# Altium schematic sheet 06_POWER_3.SchDoc
size 420 x 297 mm; SheetNumber: 9; SheetTotal: 35
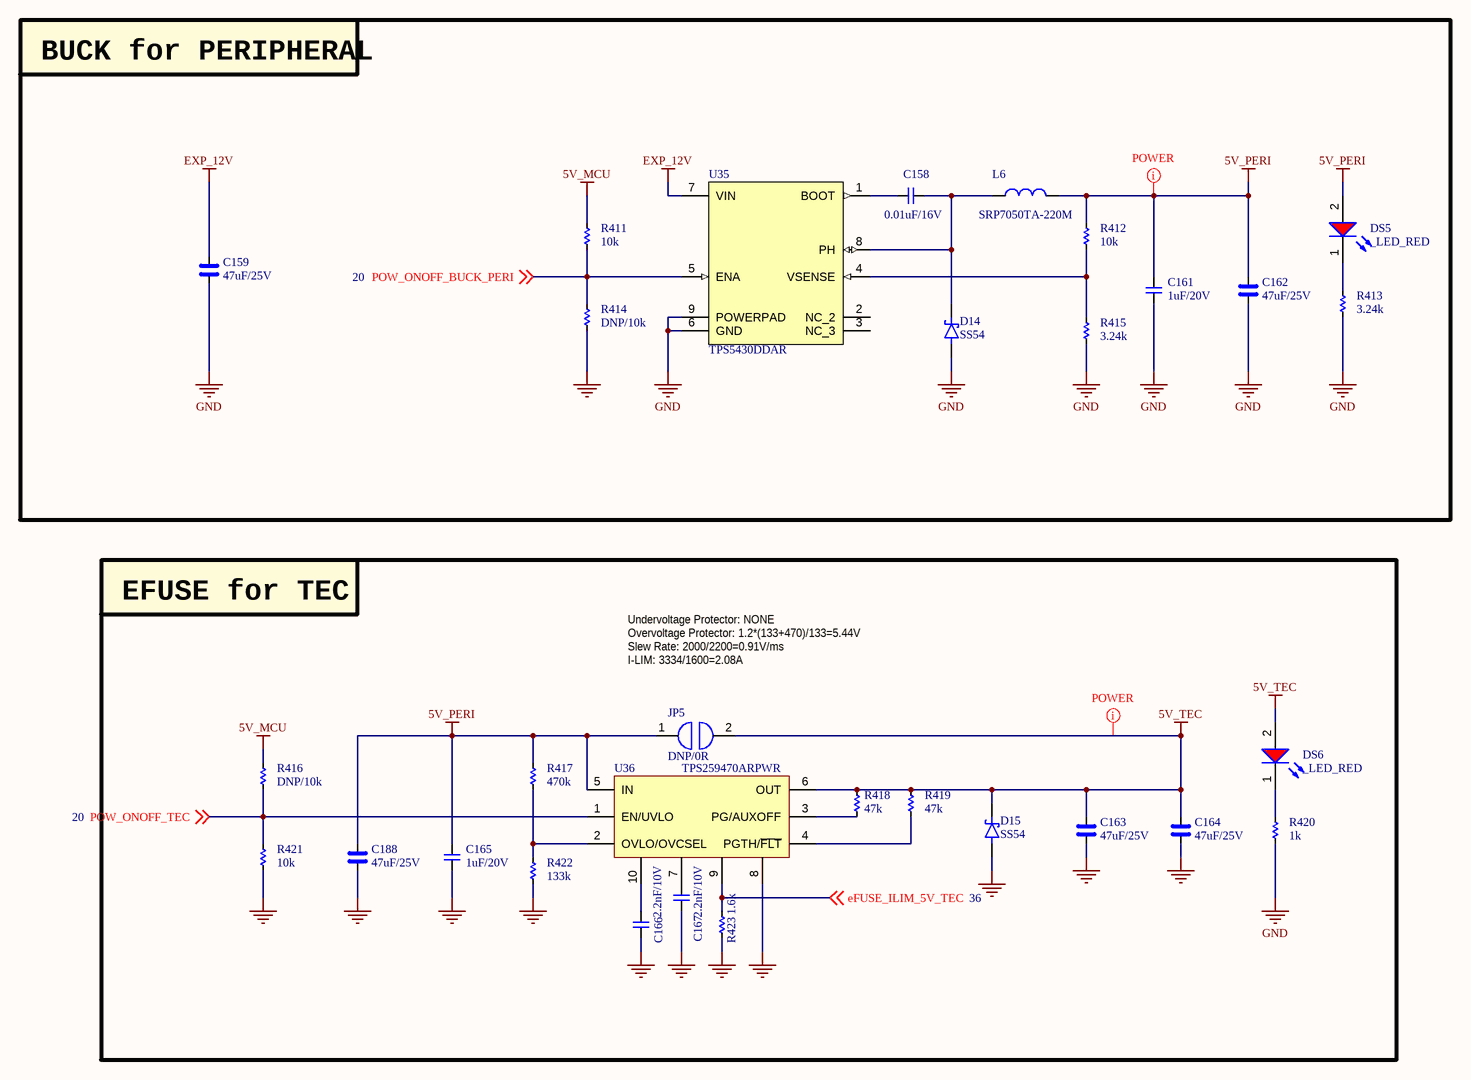
[diagram p0: 06_POWER_3.SchDoc]

## Parts
C158  0.01uF/16V  [CAP_C_1608X80]
C159  47uF/25V  [CAP_C_3225X80]
C161  1uF/20V  [CAP_C_1005X60]
C162  47uF/25V  [CAP_C_3225X80]
C163  47uF/25V  [CAP_C_3225X80]
C164  47uF/25V  [CAP_C_3225X80]
C165  1uF/20V  [CAP_C_1005X60]
C166  2.2nF/10V  [CAP_C_1005X60]
C167  2.2nF/10V  [CAP_C_1005X60]
C188  47uF/25V  [CAP_C_3225X80]
D14  SS54  [DO-214AC_SMA]
D15  SS54  [DO-214AC_SMA]
DS5  _LED_RED  [LED_0603]
DS6  _LED_RED  [LED_0603]
JP5  DNP/0R  [JUMPER_1608]
L6  SRP7050TA-220M  [PSM6050]
R411  10k  [RES_C_1005X40]
R412  10k  [RES_C_1005X40]
R413  3.24k  [RES_C_1005X40]
R414  DNP/10k  [RES_C_1005X40]
R415  3.24k  [RES_C_1005X40]
R416  DNP/10k  [RES_C_1005X40]
R417  470k  [RES_C_1005X40]
R418  47k  [RES_C_1005X40]
R419  47k  [RES_C_1005X40]
R420  1k  [RES_C_1005X40]
R421  10k  [RES_C_1005X40]
R422  133k  [RES_C_1005X40]
R423  1.6k  [RES_C_1005X40]
U35  TPS5430DDAR  [TPS54531DDAR]
U36  TPS259470ARPWR  [VQFN-HR-10]

## Blocks framed on the sheet
BUCK for PERIPHERAL: C158 C159 C161 C162 D14 DS5 L6 R411-R415 U35
EFUSE for TEC: C163-C167 C188 D15 DS6 JP5 R416-R423 U36

## Nets
5V_MCU: R411.1 R416.1
5V_PERI: C161.2 C162.2 C165.2 C188.2 DS5.2(A) JP5.1 L6.2 R412.2 R417.2 U36.5(IN)
5V_TEC: C163.2 C164.2 D15.1(K) DS6.2(A) JP5.2 R418.2 R419.2 U36.6(OUT)
EXP_12V: C159.2 U35.7(VIN)
GND: C159.1 C161.1 C162.1 C163.1 C164.1 C165.1 C166.1 C167.1 C188.1 D14.2(A) D15.2(A) R413.1 R414.2 R415.1 R420.1 R421.2 R422.1 R423.1 U35.6(GND) U35.9(POWERPAD) U36.8
eFUSE_ILIM_5V_TEC: R423.2 U36.9 ; off-sheet eFUSE_ILIM_5V_TEC
POW_ONOFF_BUCK_PERI: R411.2 R414.1 U35.5(ENA) ; off-sheet POW_ONOFF_BUCK_PERI
POW_ONOFF_TEC: R416.2 R421.1 U36.1(EN/UVLO) ; off-sheet POW_ONOFF_TEC
NetC158_1: C158.1 D14.1(K) L6.1 U35.8(PH)
NetC158_2: C158.2 U35.1(BOOT)
NetC166_2: C166.2 U36.10
NetC167_2: C167.2 U36.7
NetDS5_1: DS5.1(K) R413.2
NetDS6_1: DS6.1(K) R420.2
NetR412_1: R412.1 R415.2 U35.4(VSENSE)
NetR417_1: R417.1 R422.2 U36.2(OVLO/OVCSEL)
NetR418_1: R418.1 U36.3(PG/AUXOFF)
NetR419_1: R419.1 U36.4(PGTH/~{FLT})

Not connected (* = marked no-connect by the designer): U35 2(NC_2) 3(NC_3)

## Layout directives
net class POWER: 5V_PERI, 5V_TEC

## Notes on the sheet
- Undervoltage Protector: NONE
- Overvoltage Protector: 1.2*(133+470)/133=5.44V
- Slew Rate: 2000/2200=0.91V/ms
- I-LIM: 3334/1600=2.08A
- Project:
- Sub-system:
- Design by:
- Sheet title:
- Sheet
- of
- Checked by:
- Approved by:
- Revision:
- Document No:
- Size:
- Date:
- A3

## Library data of the parts
C158 C161 C165-C167 = _CAP_C_2: CAP
C159 C162-C164 C188 = _CAP_C_High_2: CAP High Value
D14 D15 = DIODE SCHOTTKY
JP5 = JUMPER
L6 = SRP7050TA-220M: FIXED IND 22UH 2.5A 170 MOHM SMD
R411-R423 = _RES_B_2: RES
U35 = TPS5430DDAR: IC REG BUCK ADJ 3A 8SOPWR